# Altium schematic sheet DiPho_PoE_adapter.SchDoc: DiPho adapter
size 420 x 297 mm; Author: P.Daniel; CompanyName: WUT ISE; DrawnBy: P.Daniel; Organization: WUT ISE; Address1: WUT ISE; Address2: Nowowiejska 15/19 00-665 Warsaw; Address3: piotrmaciejdaniel@gmail.com; Revision: 1; SheetNumber: 1; SheetTotal: 1; ModifiedBy: -; CreateDate: 12.2021; CheckedDate: -; Title2: schematic; DivGrp: WUT ISE; Designer: Piotr Daniel; ModifiedDate: -; ProjectName: Sensor Box
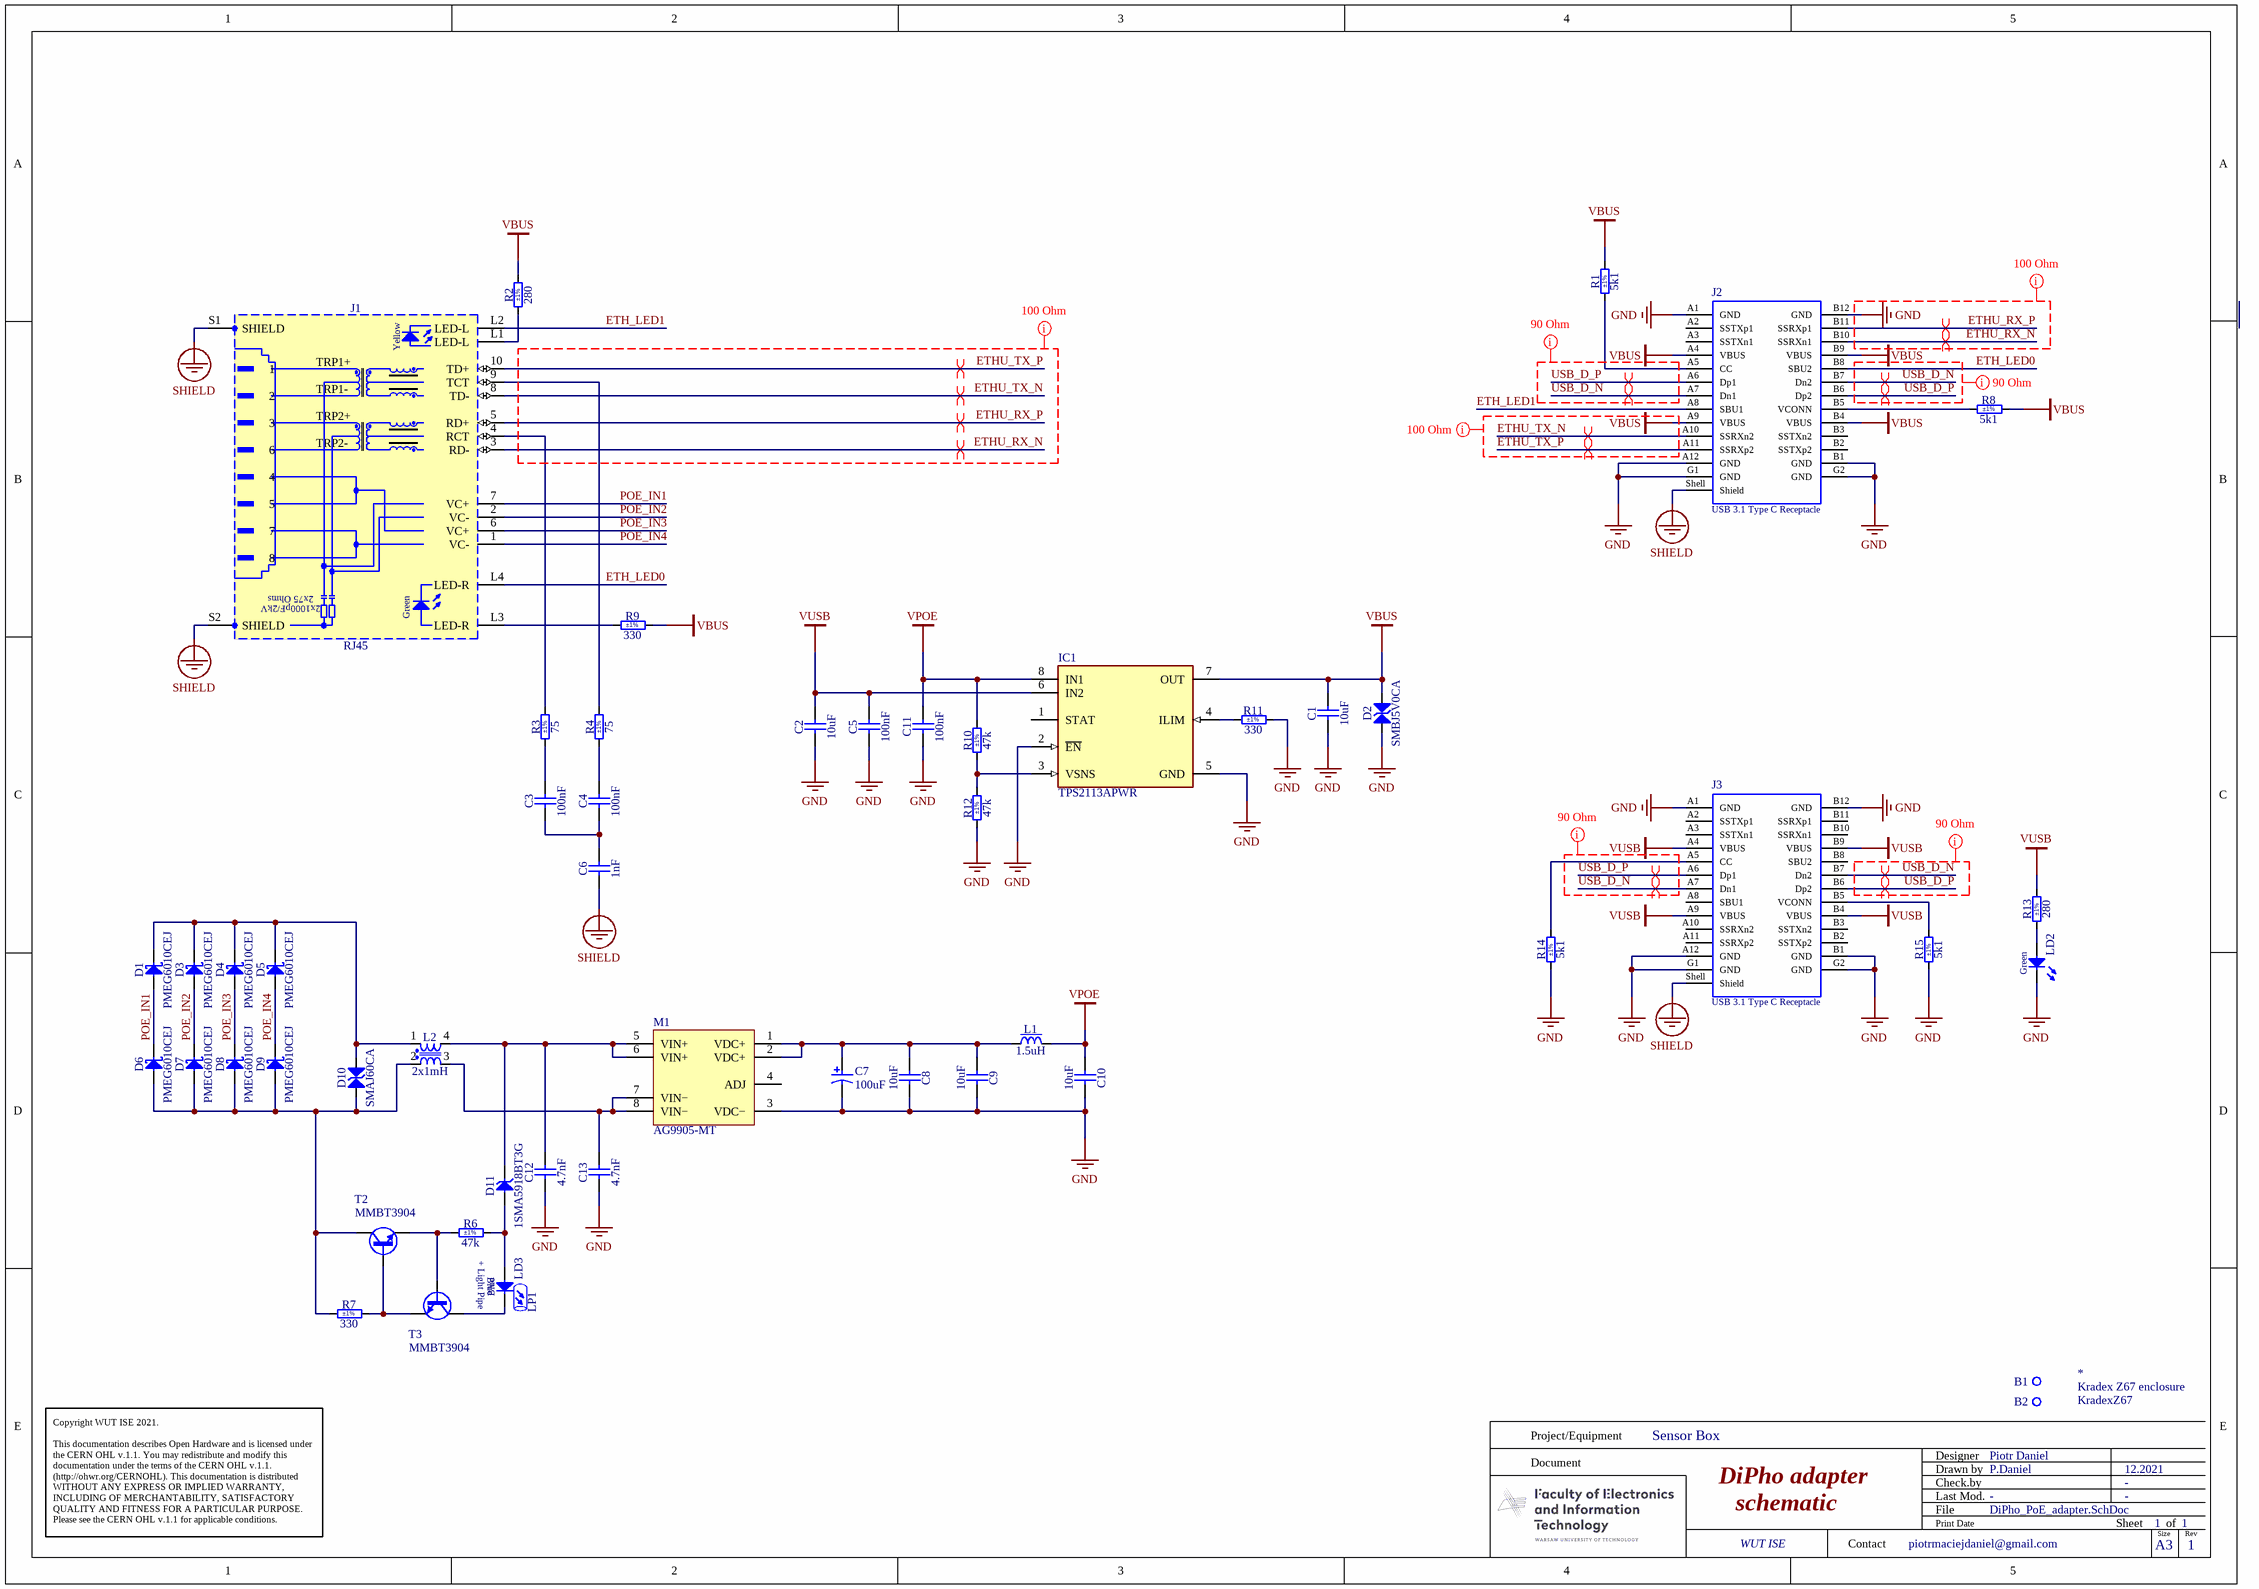
[diagram p0: DiPho_PoE_adapter.SchDoc]

## Parts
*  KradexZ67  [KradexZ67]
B1  Plated Hole  [MTG300_600]  (value not drawn)  (no BOM)
B2  Plated Hole  [MTG300_600]  (value not drawn)  (no BOM)
C1  10uF  [CAPC3225X270N]
C2  10uF  [CAPC3225X270N]
C3  100nF  [CAPC1608X90N]
C4  100nF  [CAPC1608X90N]
C5  100nF  [CAPC1608X90N]
C6  1nF  [CAPC3216X180N]
C7  100uF  [PNSC-EEEFK1C101P_L]
C8  10uF  [CAPC3225X270N]
C9  10uF  [CAPC3225X270N]
C10  10uF  [CAPC3225X270N]
C11  100nF  [CAPC1608X90N]
C12  4.7nF  [CAPC3216X180N]
C13  4.7nF  [CAPC3216X180N]
D1  PMEG6010CEJ  [SODFL2513X80N]
D2  SMBJ5V0CA  [DIOM5336X265N]
D3  PMEG6010CEJ  [SODFL2513X80N]
D4  PMEG6010CEJ  [SODFL2513X80N]
D5  PMEG6010CEJ  [SODFL2513X80N]
D6  PMEG6010CEJ  [SODFL2513X80N]
D7  PMEG6010CEJ  [SODFL2513X80N]
D8  PMEG6010CEJ  [SODFL2513X80N]
D9  PMEG6010CEJ  [SODFL2513X80N]
D10  SMAJ60CA  [DIOM5226X262N]
D11  1SMA5918BT3G  [DIOM5226X220N]
IC1  TPS2113APWR  [FP-PW0008A-MFG]
J1  RJ45  [ABRACON_ARJM11C7-114-BA-EW2]
J2  USB 3.1 Type C Receptacle  [632723300011]
J3  USB 3.1 Type C Receptacle  [632723300011]
L1  1.5uH  [IND_COILCRAFT_1812CS]
L2  2x1mH  [IND_WURTH_WE-SL2]
LD2  Green  [LED_KINGBRIGHT_KPT-2012ZGC]
LD3  Blue  [LED_KINGBRIGHT_KPT-2012VBC-D]
LP1  (no value)  [LEDLP_DIALIGHT_515-1049F]
M1  AG9905-MT  [SILVERTEL_AG9900]
R1  5k1  Tolerance: ±1%  [RESC1608X55N]
R2  280  Tolerance: ±1%  [RESC1608X55N]
R3  75  Tolerance: ±1%  [RESC1608X55N]
R4  75  Tolerance: ±1%  [RESC1608X55N]
R6  47k  Tolerance: ±1%  [RESC1608X55N]
R7  330  Tolerance: ±1%  [RESC1608X55N]
R8  5k1  Tolerance: ±1%  [RESC1608X55N]
R9  330  Tolerance: ±1%  [RESC1608X55N]
R10  47k  Tolerance: ±1%  [RESC1608X55N]
R11  330  Tolerance: ±1%  [RESC1608X55N]
R12  47k  Tolerance: ±1%  [RESC1608X55N]
R13  280  Tolerance: ±1%  [RESC1608X55N]
R14  5k1  Tolerance: ±1%  [RESC1608X55N]
R15  5k1  Tolerance: ±1%  [RESC1608X55N]
T2  MMBT3904  [SOT95P230X110-3N]
T3  MMBT3904  [SOT95P230X110-3N]

## Nets
GND: C1.1 C2.1 C5.1 C7.2 C8.2 C9.2 C10.2 C11.1 C12.1 C13.1 D2.1 IC1.2(~{EN}) IC1.5(GND) J2.A1(GND) J2.A12(GND) J2.B1(GND) J2.B12(GND) J2.G1(GND) J2.G2(GND) J3.A1(GND) J3.A12(GND) J3.B1(GND) J3.B12(GND) J3.G1(GND) J3.G2(GND) LD2.1(C) M1.3(VDC−) R11.2 R12.1 R14.1 R15.1
SHIELD: C6.1 J1.S1(SHIELD) J1.S2(SHIELD) J2.Shell(Shield) J3.Shell(Shield)
VBUS: C1.2 D2.2 IC1.7(OUT) J2.A4(VBUS) J2.A9(VBUS) J2.B4(VBUS) J2.B9(VBUS) R1.2 R2.2 R8.2 R9.2
VPOE: C10.1 C11.2 IC1.8(IN1) L1.2 R10.2
VUSB: C2.2 C5.2 IC1.6(IN2) J3.A4(VBUS) J3.A9(VBUS) J3.B4(VBUS) J3.B9(VBUS) R13.2
ETH_LED0: J1.L4(LED-R) J2.B8(SBU2)
ETH_LED1: J1.L2(LED-L) J2.A8(SBU1)
ETHU_RX_N: J1.3(RD-) J2.B10(SSRXn1)
ETHU_RX_P: J1.5(RD+) J2.B11(SSRXp1)
ETHU_TX_N: J1.8(TD-) J2.A10(SSRXn2)
ETHU_TX_P: J1.10(TD+) J2.A11(SSRXp2)
POE_IN1: D1.2(A) D6.1(C) J1.7(VC+)
POE_IN2: D3.2(A) D7.1(C) J1.2(VC-)
POE_IN3: D4.2(A) D8.1(C) J1.6(VC+)
POE_IN4: D5.2(A) D9.1(C) J1.1(VC-)
USB_D_N: J2.A7(Dn1) J2.B7(Dn2) J3.A7(Dn1) J3.B7(Dn2)
USB_D_P: J2.A6(Dp1) J2.B6(Dp2) J3.A6(Dp1) J3.B6(Dp2)
NetC3_1: C3.1 C4.1 C6.2
NetC3_2: C3.2 R3.1
NetC4_2: C4.2 R4.1
NetC7_1: C7.1 C8.1 C9.1 L1.1 M1.1(VDC+) M1.2(VDC+)
NetC12_2: C12.2 D11.1(C) L2.4 M1.5(VIN+) M1.6(VIN+)
NetC13_2: C13.2 L2.3 M1.7(VIN−) M1.8(VIN−)
NetD1_1: D1.1(C) D3.1(C) D4.1(C) D5.1(C) D10.2 L2.1
NetD6_2: D6.2(A) D7.2(A) D8.2(A) D9.2(A) D10.1 L2.2 R7.1 T2.3(C)
NetD11_2: D11.2(A) LD3.2(A) R6.2
NetIC1_3: IC1.3(VSNS) R10.1 R12.2
NetIC1_4: IC1.4(ILIM) R11.1
NetJ1_4: J1.4(RCT) R3.2
NetJ1_9: J1.9(TCT) R4.2
NetJ1_L1: J1.L1(LED-L) R2.1
NetJ1_L3: J1.L3(LED-R) R9.1
NetJ2_A5: J2.A5(CC) R1.1
NetJ2_B5: J2.B5(VCONN) R8.1
NetJ3_A5: J3.A5(CC) R14.2
NetJ3_B5: J3.B5(VCONN) R15.2
NetLD2_2: LD2.2(A) R13.1
NetLD3_1: LD3.1(C) T3.3(C)
NetR6_1: R6.1 T2.2(E) T3.1(B)
NetR7_2: R7.2 T2.1(B) T3.2(E)

Not connected (* = marked no-connect by the designer): B1 1; B2 1; IC1 1(STAT); J2 A2(SSTXp1) A3(SSTXn1) B2(SSTXp2) B3(SSTXn2); J3 A2(SSTXp1) A3(SSTXn1) A8(SBU1) A10(SSRXn2) A11(SSRXp2) B2(SSTXp2) B3(SSTXn2) B8(SBU2) B10(SSRXn1) B11(SSRXp1); M1 4(ADJ)

## Layout directives
differential pair: ETHU_RX_N, ETHU_RX_P, ETHU_TX_N, ETHU_TX_P, USB_D_N, USB_D_P
rule Differential Pairs Routing [Pref Gap = 5mil    Min Gap  = 5mil    Max Gap  = 5milPref Width = 6.5mil    Min Width  = 6.5mil    Max Width  = 6.5mil]: ETHU_RX_N, ETHU_RX_P, ETHU_TX_N, ETHU_TX_P, GND, VBUS
rule Differential Pairs Routing [Pref Gap = 6mil    Min Gap  = 6mil    Max Gap  = 6milPref Width = 9.25mil    Min Width  = 8mil    Max Width  = 9.25mil]: USB_D_N, USB_D_P

## Notes on the sheet
- Project/Equipment
- Document
- Designer
- Drawn by
- Check.by
- Copyright WUT ISE 2021.
  This documentation describes Open Hardware and is licensed under the CERN OHL v.1.1. You may redistribute and modify this documentation under the terms of the CERN OHL v.1.1. (http://ohwr.org/CERNOHL). This documentation is distributed WITHOUT ANY EXPRESS OR IMPLIED WARRANTY, INCLUDING OF MERCHANTABILITY, SATISFACTORY QUALITY AND FITNESS FOR A PARTICULAR PURPOSE. Please see the CERN OHL v.1.1 for applicable conditions.
- Contact
- File
- Last Mod.
- Print Date
- Sheet
- Size
- A3
- of
- Rev
- (in symbol CON_ETH_POE_ARJM11C7) Yellow; TRP1+; TRP1-; TRP2+; TRP2-; 2x75 Ohms; Green; 2x1000pF/2kV
- (in symbol KradexZ67) Kradex Z67 enclosure
- (in symbol LEDLP_DIALIGHT_515-1049F) + Light Pipe

## Library data of the parts
B1 B2 = PLATED_HOLE3.0_PAD6.0: Single Terminal Socket; Part Description: Plated Through Hole: Hole Dia.=3.0mm Pad Dia.=6.0mm; Mounted: No; Part Number: PLATED_HOLE3.0_PAD6.0; Component Type: Standard (No BOM); Pin Count: 1; Family: Plated Hole; Socket: No; SMD: No; Sense: No; Status: None; ComponentHeight: 0mm; HelpURL: Undefined; Author: CERN DEM JLC; CreateDate: 26.05.2008; LatestRevisionDate: 26.05.2008; PackageDescription: Plated Through Hole: Hole Dia.=3.0mm Pad Dia.=6.0mm
C1 C2 C8-C10 = CC1210_10UF_25V_10%_X7R: Non-polarised capacitor; Part Description: SMD Multilayer Chip Ceramic Capacitor; Manufacturer: GENERIC; Manufacturer1 Part Number: C1210C106K4RACTU; Voltage: 25V; TC: X7R; Tolerance: ±10%; Part Number: CC1210_10UF_25V_10%_X7R; Component Kind: Standard; Component Type: Standard; Pin Count: 2; Value: 10uF; Status: None; Manufacturer Part Number: CC1210_10UF_25V_10%_X7R; Case: 1210; Mounted: Yes; Socket: No; SMD: Yes; Sense: No; Manufacturer1 Example: KEMET; Manufacturer1 ComponentHeight: 2.7mm; HelpURL: \\cern.ch\dfs\Applications\Altium\Datasheets\CC1210_X7R_KEMET.pdf; Author: CERN DEM JLC; CreateDate: 05.05.2009; LatestRevisionDate: 01.04.2010
C3-C5 C11 = CC0603_100NF_100V_10%_X7R: Non-polarised capacitor; Part Description: SMD Multilayer Chip Ceramic Capacitor; Manufacturer: GENERIC; Manufacturer1 Part Number: GRM188R72A104KA35D; Voltage: 100V; TC: X7R; Tolerance: ±10%; Part Number: CC0603_100NF_100V_10%_X7R; Component Kind: Standard; Component Type: Standard; Pin Count: 2; Value: 100nF; Status: None; Manufacturer Part Number: CC0603_100NF_100V_10%_X7R; Case: 0603; Mounted: Yes; Socket: No; SMD: Yes; Sense: No; Manufacturer1 Example: MURATA; Manufacturer1 ComponentHeight: 0.9mm; HelpURL: \\cern.ch\dfs\Applications\Altium\Datasheets\CC0603_MURATA_GRM188R72A104KA35D.pdf; Author: CERN DEM JLC; CreateDate: 11.12.2013; LatestRevisionDate: 11.12.2013
C6 C12 C13 = CC1206_1NF_2KV_10%_X7R: Non-polarised capacitor; Part Description: High Voltage MLC Chip Capacitor; Manufacturer: GENERIC; Manufacturer1 Part Number: 1206GC102KAT2A; Voltage: 2kV; TC: X7R; Tolerance: ±10%; Part Number: CC1206_1NF_2KV_10%_X7R; Component Kind: Standard; Component Type: Standard; Pin Count: 2; Status: None; Manufacturer Part Number: CC1206_1NF_2KV_10%_X7R; Case: 1206; Mounted: Yes; Socket: No; SMD: Yes; Sense: No; Manufacturer1 Example: AVX; Manufacturer1 ComponentHeight: 1.8mm; HelpURL: \\cern.ch\dfs\Applications\Altium\Datasheets\CC1206_X7R_AVX_HV-MLC.pdf; Author: CERN DEM JLC; CreateDate: 19.11.2012; LatestRevisionDate: 17.05.2017
  C6: Value: 1nF
  C12 C13: Value: 4.7nF
C7 = CMP-2000-06203-1: Aluminum Electrolytic Capacitor, 100 uF, 20%, 16 V, -55 to 105 degC, 2-Pin SMD, RoHS, Tape and Reel; Manufacturer: Panasonic; Lifetime@Temperature: 2000Hrs@105°C; Impedance: 0.36O; Ripple Current: 240mA; Rated Voltage: 16V; Type: Can; Capacitance: 100µF; Datasheet URL: http://datasheet.octopart.com/EEEFK1C101P-Panasonic-datasheet-13266987.pdf; Package Description: 2-Pin Surface Mount Device, Body 6.6 x 6.6 mm; Manufacturer URL: http://www.panasonic.com/; Case Size/Dimension: Ø6.3x5.8mm; Series: FK; Datasheet Version: 11/2012; Mounting Technology: SurfaceMount; Package Reference: EEEFK1C101P; Operating Temp-Max: 105°C; Operating Temp Range: -55to+105°C
D1 D3-D9 = PMEG6010CEJ: Schottky Diode; Part Description: 1A Very Low Vf MEGA Schottky Barrier Rectifier; Manufacturer: NEXPERIA; Voltage: 60V; Power: 1A; PressFit: No; Bonding: No; Part Number: PMEG6010CEJ; Component Kind: Standard; Component Type: Standard; Device: PMEG6010CEJ; PackageDescription: SODFL Diode (SOD323F); 1.70mm W X 1.25mm L X 0.80mm H body, IPC Medium Density; Manufacturer Part Number: PMEG6010CEJ; Pin Count: 2; Case: SOD-323F; Mounted: Yes; Socket: No; SMD: Yes; Sense: No; ComponentHeight: 0.8mm; HelpURL: \\cern.ch\dfs\Applications\Altium\Datasheets\PMEG6010CEJ.pdf; Author: CERN DEM BC; CreateDate: 20.08.2020; LatestRevisionDate: 20.08.2020
D2 = SMBJ5V0CA: Transient Voltage Suppressor Diode (Bi-Directional); Part Description: Bi-Directional Transient Voltage Suppressor Diode; Manufacturer: FAIRCHILD SEMICONDUCTOR; Voltage: 5V; Power: 600W; PressFit: No; Bonding: No; Part Number: SMBJ5V0CA; Component Kind: Standard; Component Type: Standard; Device: SMBJ5V0CA; PackageDescription: DO-214-AA/SMB Diode, Molded Body; 5.34mm L X 3.625mm W X 2.65mm H, IPC Medium Density; Manufacturer Part Number: SMBJ5V0CA; Pin Count: 2; Case: DO-214AA; Mounted: Yes; Socket: No; SMD: Yes; Sense: No; ComponentHeight: 2.65mm; HelpURL: \\cern.ch\dfs\Applications\Altium\Datasheets\SMBJ.pdf; Author: CERN DEM JLC; CreateDate: 11.06.2008; LatestRevisionDate: 19.12.2011
D10 = SMAJ60CA: Transient Voltage Suppressor Diode (Bi-Directional); Part Description: Surface Mount Bi-directional Transient Voltage Suppressor Diode; Manufacturer: BOURNS; Voltage: 60V; Power: 400W; PressFit: No; Bonding: No; Part Number: SMAJ60CA; Component Kind: Standard; Component Type: Standard; Device: SMAJ60CA; PackageDescription: DO-214-AC/SMA Diode, Molded Body; 5.21mm L X 2.605mm W X 2.62mm H, IPC Medium Density; Manufacturer Part Number: SMAJ60CA; Pin Count: 2; Case: DO-214AC; Mounted: Yes; Socket: No; SMD: Yes; Sense: No; ComponentHeight: 2.62mm; HelpURL: \\cern.ch\dfs\Applications\Altium\Datasheets\SMAJ60CA.pdf; Author: CERN DEM JLC; CreateDate: 12.03.2019; LatestRevisionDate: 12.03.2019
D11 = 1SMA5918BT3G: Zener Diode; Part Description: Zener Voltage Regulators; Manufacturer: ON SEMICONDUCTOR; Voltage: 5.1V; Power: 1.5W; PressFit: No; Bonding: No; Part Number: 1SMA5918BT3G; Component Kind: Standard; Component Type: Standard; Device: 1SMA5918BT3G; PackageDescription: DO-214-AC/SMA Diode, Molded Body; 5.21mm L X 2.60mm W X 2.20mm H, IPC Medium Density; Manufacturer Part Number: 1SMA5918BT3G; Pin Count: 2; Case: DO-214AC; Mounted: Yes; Socket: No; SMD: Yes; Sense: No; ComponentHeight: 2.20mm; HelpURL: \\cern.ch\dfs\Applications\Altium\Datasheets\1SMA5918BT3G.pdf; Author: CERN DEM JLC; CreateDate: 16.02.2012; LatestRevisionDate: 16.02.2012
IC1 = CMP-0339-00047-3: IC OR CTRLR SRC SELECT 8TSSOP; Current - Output 2: 1.25A; Number of Outputs: 1; Turn-On Delay Time: 1ms; Max Power Dissipation: 387mW; Operating Supply Current: 55uA; Turn-Off Delay Time: 5ms; Min Input Voltage: 2.8V; Output Voltage: 6V; Number of Inputs: 2; Operating Supply Voltage: 5.5V; On-State Resistance: 84mR; Max Operating Temperature: 85°C; Package Quantity: 2000; Min Operating Temperature: -40°C; Case/Package: TSSOP; REACH SVHC: No SVHC; Packaging: Tape and Reel; Weight: 0.001376oz; Number of Pins: 8; Output Current: 1.25A; Radiation Hardening: No; Max Output Current: 1.25A; Lead Free: Lead Free; Max Input Voltage: 5.5V
J1 = CON_ETH_POE_ARJM11C7: MagJack 10/100BaseT, PoE+, 1X1, OG/Y, -40 to 85*C, Tab Up, RoHS; Part Number: ARJM11C7-114-BA-EW2; Part Description: 1 Port, Orange Green/Yellow LEDs, RJ45 10/100BaseT, PoE, Ethernet MagJack® Connector Module; Manufacturer: Abracon; PressFit: No; Component Kind: Standard; Component Type: Standard; Pin Count: 18; Family: RJ45; Mounted: Yes; Socket: No; SMD: No; Sense: No; Status: None; Manufacturer Part Number: ARJM11C7-114-BA-EW2; ComponentHeight: 13.61mm; HelpURL: \\cern.ch\dfs\Applications\Altium\Datasheets\BELFUSE_0826-1X1T-GJ-F.pdf; Author: GK; CreateDate: 05.11.2012; LatestRevisionDate: 05.11.2012
J2 J3 = 632723300011: USB 3.1 Type C, Receptacle, Horizontal, THR; Manufacturer: Wurth Elektronik; Rated Current: 5A; Pin Number: 24; Interface Type: Type C; Working Voltage: 20VAC; ComponentLink1Description: Manufacturer; ComponentLink1URL: http://www.we-online.de; ComponentLink2Description: Datasheet; ComponentLink2URL: https://katalog.we-online.com/em/datasheet/632723300011.pdf; Published Date: August 2020; Manufacturer Part Number: 632723300011; Gender: Receptacle; Type: Horizontal; Packaging: Tape and Reel; Operating Temperature: -40 to +105degC; Mounting Technology: THR; Application: USB 3.1
L1 = IND_1.5UH_2%_COILCRAFT_1812CS: Inductor With Core; Part Description: SMT Chip Inductor; Manufacturer Part Number: 1812CS-152XGL; Power: 430mA; Resistance: 1.6R; Tolerance: ±2%; Part Number: IND_1.5UH_2%_COILCRAFT_1812CS; Component Kind: Standard; Component Type: Standard; Pin Count: 2; Value: 1.5uH; Status: None; Manufacturer: COILCRAFT; Case: 1812; Mounted: Yes; Socket: No; SMD: Yes; Sense: No; ComponentHeight: 3.43mm; HelpURL: \\cern.ch\dfs\Applications\Altium\Datasheets\IND_COILCRAFT_1812CS.pdf; Author: CERN DEM JMW; CreateDate: 26.10.2015; LatestRevisionDate: 26.10.2015
L2 = IND_1MH_50%_WURTH_WE-SL2-744222: Inductor Common Mode; Part Description: Common Mode SMD Line Filter (WE-SL2 Series); Manufacturer: WURTH ELEKTRONIK; Manufacturer Part Number: 744222; Power: 800mA; Resistance: 0.31R; Tolerance: ±50%; Part Number: IND_1MH_50%_WURTH_WE-SL2-744222; Component Kind: Standard; Component Type: Standard; Pin Count: 4; Value: 2x1mH; Status: None; Mounted: Yes; Socket: No; SMD: Yes; Sense: No; ComponentHeight: 5.3mm; HelpURL: \\cern.ch\dfs\Applications\Altium\Datasheets\IND_WURTH_WE-SL2_744222.pdf; Author: CERN DEM JLC; CreateDate: 04.06.2012; LatestRevisionDate: 15.10.2012
LD2 = LED_KINGBRIGHT_KPT-2012ZGC: LED Green 1C 2A; Part Description: 2.0X1.25mm, SMD Green Chip LED Lamp, KPT-2012 Series; PressFit: No; Bonding: No; Part Number: LED_KINGBRIGHT_KPT-2012ZGC; Component Kind: Standard; Component Type: Standard; Color: Green; PackageDescription: SMT Green LED, Case 2012, Body L 2.00mm X  W 1.25mm X H 0.75mm; Manufacturer: KINGBRIGHT; Manufacturer Part Number: KPT-2012ZGC; Pin Count: 2; Case: 0805; Mounted: Yes; Socket: No; SMD: Yes; Sense: No; ComponentHeight: 0.75mm; HelpURL: \\cern.ch\dfs\Applications\Altium\Datasheets\LED_KINGBRIGHT_KPT-2012ZGC.pdf; Author: CERN DEM BC; CreateDate: 27.01.2021; LatestRevisionDate: 27.01.2021
LD3 = LED_KINGBRIGHT_KPT-2012VBC-D: LED Blue 1C 2A; Part Description: 2.0X1.25mm, SMD Blue Chip LED Lamp, KPT-2012 Series; PressFit: No; Bonding: No; Part Number: LED_KINGBRIGHT_KPT-2012VBC-D; Component Kind: Standard; Component Type: Standard; Color: Blue; PackageDescription: SMT Blue LED, Case 2012, Body L 2.00mm X  W 1.25mm X H 0.75mm; Manufacturer: KINGBRIGHT; Manufacturer Part Number: KPT-2012VBC-D; Pin Count: 2; Case: 0805; Mounted: Yes; Socket: No; SMD: Yes; Sense: No; ComponentHeight: 0.75mm; HelpURL: \\cern.ch\dfs\Applications\Altium\Datasheets\LED_KINGBRIGHT_KPT-2012VBC-D.pdf; Author: CERN DEM BC; CreateDate: 27.01.2021; LatestRevisionDate: 27.01.2021
LP1 = LEDLP_DIALIGHT_515-1049F: LED Light Pipe x1 Type1; Part Description: Right Angle Single Element 3.56mm Round Lightpipe; PressFit: No; Bonding: No; Part Number: LEDLP_DIALIGHT_515-1049F; Component Kind: Accessories; Component Type: Standard; PackageDescription: Right Angle Single Element 3.56mm Round Lightpipe; Manufacturer: DIALIGHT; Manufacturer Part Number: 515-1049F; Pin Count: 0; Mounted: Yes; Socket: No; SMD: No; Sense: No; ComponentHeight: 5.3mm; HelpURL: \\cern.ch\dfs\Applications\Altium\Datasheets\LEDLP_DIALIGHT_515-1049F.pdf; Author: CERN DEM JLC; CreateDate: 24.01.2017; LatestRevisionDate: 24.01.2017
M1 = AG9905-MT: Ultra Miniature PoE, 5V, w/Thermal Protection; Manufacturer: Silvertel; Supplier 1: Mouser; Manufacturer Part Number: AG9905-MT; RoHS: No; Pricing 1: 1=8,19000, 10=8,13000, 20=7,75000, 50=7,75000, 100=7,14000, 1000=7,14000, 10000=7,14000 (USD); Supplier Part Number 1: 480-AG9905MT
R1 R8 R14 R15 = R0603_5K1_1%_0.1W_100PPM: Resistor - 1%; Part Description: General Purpose Thick Film Chip Resistor; Manufacturer: GENERIC; Manufacturer1 Part Number: NRC06F5101TRF; Power: 0.1W; TC: ±100ppm/°C; PressFit: No; Part Number: R0603_5K1_1%_0.1W_100PPM; Component Kind: Standard; Component Type: Standard; Pin Count: 2; Value: 5k1; Status: Preferred; Manufacturer Part Number: R0603_5K1_1%_0.1W_100PPM; Case: 0603; Mounted: Yes; Sense: No; Socket: No; SMD: Yes; Manufacturer1 Example: NIC COMPONENT; Manufacturer1 ComponentHeight: 0.55mm; HelpURL: \\cern.ch\dfs\Applications\Altium\Datasheets\R0603_NIC_NRC.pdf; Author: CERN DEM JLC; CreateDate: 03.12.2007; LatestRevisionDate: 13.03.2008
R2 R13 = R0603_280R_1%_0.1W_100PPM: Resistor - 1%; Part Description: General Purpose Thick Film Chip Resistor; Manufacturer: GENERIC; Manufacturer1 Part Number: CRCW0603280RFKEA; Power: 0.1W; TC: ±100ppm/°C; PressFit: No; Part Number: R0603_280R_1%_0.1W_100PPM; Component Kind: Standard; Component Type: Standard; Pin Count: 2; Value: 280; Status: Preferred; Manufacturer Part Number: R0603_280R_1%_0.1W_100PPM; Case: 0603; Mounted: Yes; Sense: No; Socket: No; SMD: Yes; Manufacturer1 Example: VISHAY; Manufacturer1 ComponentHeight: 0.55mm; HelpURL: \\cern.ch\dfs\Applications\Altium\Datasheets\R0603_VISHAY_CRCW e3.pdf; Author: CERN DEM JLC; CreateDate: 14.03.2018; LatestRevisionDate: 14.03.2018
R3 R4 = R0603_75R_1%_0.1W_100PPM: Resistor - 1%; Part Description: General Purpose Thick Film Chip Resistor; Manufacturer: GENERIC; Manufacturer1 Part Number: NRC06F75R0TRF; Power: 0.1W; TC: ±100ppm/°C; PressFit: No; Part Number: R0603_75R_1%_0.1W_100PPM; Component Kind: Standard; Component Type: Standard; Pin Count: 2; Value: 75; Status: Preferred; Manufacturer Part Number: R0603_75R_1%_0.1W_100PPM; Case: 0603; Mounted: Yes; Sense: No; Socket: No; SMD: Yes; Manufacturer1 Example: NIC COMPONENT; Manufacturer1 ComponentHeight: 0.55mm; HelpURL: \\cern.ch\dfs\Applications\Altium\Datasheets\R0603_NIC_NRC.pdf; Author: CERN DEM JLC; CreateDate: 03.12.2007; LatestRevisionDate: 13.03.2008
R6 R10 R12 = R0603_47K_1%_0.1W_100PPM: Resistor - 1%; Part Description: General Purpose Thick Film Chip Resistor; Manufacturer: GENERIC; Manufacturer1 Part Number: NRC06F4702TRF; Power: 0.1W; TC: ±100ppm/°C; PressFit: No; Part Number: R0603_47K_1%_0.1W_100PPM; Component Kind: Standard; Component Type: Standard; Pin Count: 2; Value: 47k; Status: Preferred; Manufacturer Part Number: R0603_47K_1%_0.1W_100PPM; Case: 0603; Mounted: Yes; Sense: No; Socket: No; SMD: Yes; Manufacturer1 Example: NIC COMPONENT; Manufacturer1 ComponentHeight: 0.55mm; HelpURL: \\cern.ch\dfs\Applications\Altium\Datasheets\R0603_NIC_NRC.pdf; Author: CERN DEM JLC; CreateDate: 03.12.2007; LatestRevisionDate: 13.03.2008
R7 R9 R11 = R0603_330R_1%_0.1W_100PPM: Resistor - 1%; Part Description: General Purpose Thick Film Chip Resistor; Manufacturer: GENERIC; Manufacturer1 Part Number: NRC06F3300TRF; Power: 0.1W; TC: ±100ppm/°C; PressFit: No; Part Number: R0603_330R_1%_0.1W_100PPM; Component Kind: Standard; Component Type: Standard; Pin Count: 2; Value: 330; Status: Preferred; Manufacturer Part Number: R0603_330R_1%_0.1W_100PPM; Case: 0603; Mounted: Yes; Sense: No; Socket: No; SMD: Yes; Manufacturer1 Example: NIC COMPONENT; Manufacturer1 ComponentHeight: 0.55mm; HelpURL: \\cern.ch\dfs\Applications\Altium\Datasheets\R0603_NIC_NRC.pdf; Author: CERN DEM JLC; CreateDate: 03.12.2007; LatestRevisionDate: 13.03.2008
T2 T3 = MMBT3904: NPN Transistor; Part Description: 40V 200mA NPN Switching Transistor; Manufacturer: NXP SEMICONDUCTORS; PressFit: No; Bonding: No; Part Number: MMBT3904; Component Kind: Standard; Component Type: Standard; Device: MMBT3904; PackageDescription: SOT23, 0.95mm Pitch; 3 Pin, 1.30mm W X 2.90mm L X 1.10mm H body, IPC Medium Density; Manufacturer Part Number: MMBT3904; Pin Count: 3; Case: SOT23-3; Mounted: Yes; Socket: No; SMD: Yes; Sense: No; ComponentHeight: 1.1mm; HelpURL: \\cern.ch\dfs\Applications\Altium\Datasheets\MMBT3904.pdf; Author: CERN DEM JLC; CreateDate: 10.02.2010; LatestRevisionDate: 10.02.2010